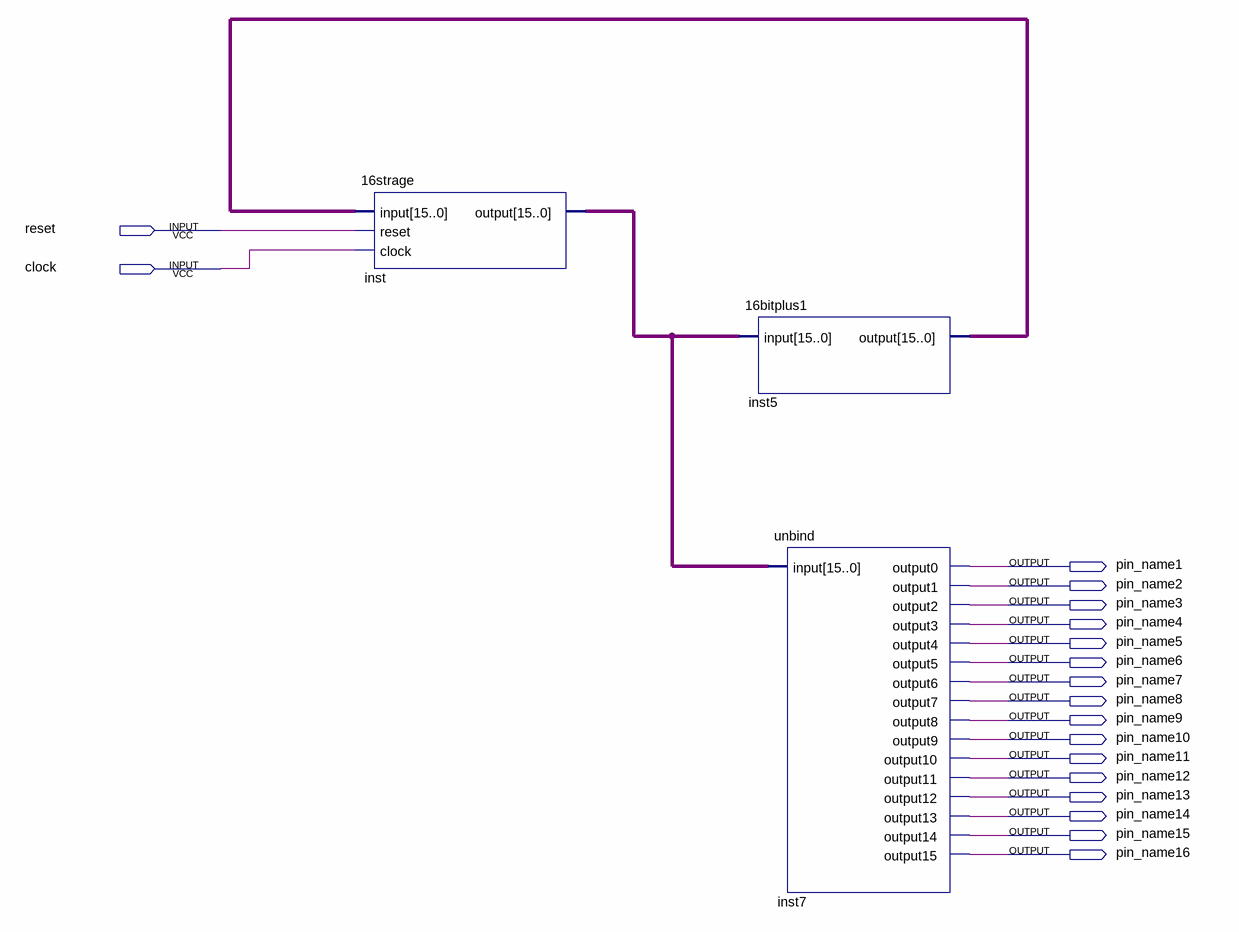
[diagram p0: schematic sheet]
// Quartus schematic processor.bdf as structural Verilog: 3 symbols, 18 pins
module processor (
  input  reset,
  input  clock,
  output pin_name1,
  output pin_name2,
  output pin_name3,
  output pin_name4,
  output pin_name5,
  output pin_name6,
  output pin_name7,
  output pin_name8,
  output pin_name9,
  output pin_name10,
  output pin_name11,
  output pin_name12,
  output pin_name13,
  output pin_name14,
  output pin_name15,
  output pin_name16
);

  wire [15:0] inst5_output, inst_output;

  \16strage  inst (.\input (inst5_output), .reset(reset), .clock(clock), .\output (inst_output));
  \16bitplus1  inst5 (.\input (inst_output), .\output (inst5_output));
  unbind inst7 (
    .\input (inst_output), .output0(pin_name1), .output1(pin_name2), .output2(pin_name3),
    .output3(pin_name4), .output4(pin_name5), .output5(pin_name6), .output6(pin_name7), .output7(pin_name8),
    .output8(pin_name9), .output9(pin_name10), .output10(pin_name11), .output11(pin_name12),
    .output12(pin_name13), .output13(pin_name14), .output14(pin_name15), .output15(pin_name16));
endmodule
